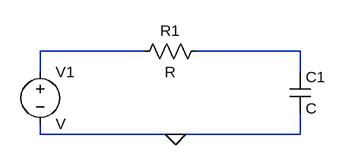
[diagram p0: schematic RC Circuit.asc]
RC Circuit.asc, the LTspice schematic file:
Version 4.1
SHEET 1 880 680
WIRE 192 128 32 128
WIRE 432 128 272 128
WIRE 32 160 32 128
WIRE 432 160 432 128
WIRE 32 256 32 240
WIRE 240 256 32 256
WIRE 432 256 432 224
WIRE 432 256 240 256
FLAG 240 256 0
SYMBOL res 288 112 R90
WINDOW 0 0 56 VBottom 2
WINDOW 3 32 56 VTop 2
SYMATTR InstName R1
SYMBOL cap 416 160 R0
SYMATTR InstName C1
SYMBOL voltage 32 144 R0
SYMATTR InstName V1

The netlist it stands for:
* RC Circuit.asc
R1 N002 N001 R
C1 N002 0 C
V1 N001 0 V
.backanno
.end